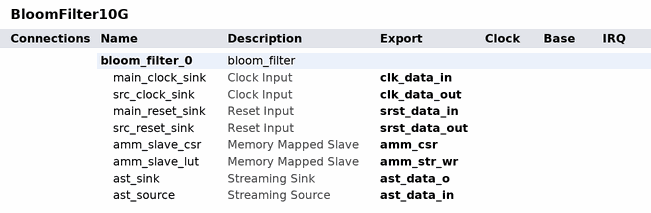
[diagram p0: system contents]
# Platform Designer (Qsys) system BloomFilter10G, Cyclone V 5CEBA2F17A7
# Parameters at their usual value, and those the tool derives, are not listed.
package require qsys
create_system BloomFilter10G
set_project_property DEVICE_FAMILY {Cyclone V}
set_project_property DEVICE 5CEBA2F17A7

add_instance bloom_filter_0 bloom_filter 1.0
set_instance_parameter_value bloom_filter_0 AMM_CSR_ADDR_W 4
set_instance_parameter_value bloom_filter_0 AMM_CSR_DATA_W 16
set_instance_parameter_value bloom_filter_0 AMM_LUT_ADDR_W 20
set_instance_parameter_value bloom_filter_0 AMM_LUT_DATA_W 8
set_instance_parameter_value bloom_filter_0 AST_SINK_ORDER true
set_instance_parameter_value bloom_filter_0 AST_SINK_SYMBOLS 8
set_instance_parameter_value bloom_filter_0 AST_SOURCE_ORDER true
set_instance_parameter_value bloom_filter_0 AST_SOURCE_SYMBOLS 1
set_instance_parameter_value bloom_filter_0 BYTE_W 8
set_instance_parameter_value bloom_filter_0 HASHES_CNT 4
set_instance_parameter_value bloom_filter_0 HASH_LUT_MODE 1
set_instance_parameter_value bloom_filter_0 HASH_W 13
set_instance_parameter_value bloom_filter_0 MAX_STR_SIZE 10
set_instance_parameter_value bloom_filter_0 MIN_STR_SIZE 4
set_instance_parameter_value bloom_filter_0 OUTPUT_FIFO_DEPTH 128

# exported interfaces
add_interface amm_csr avalon slave
set_interface_property amm_csr EXPORT_OF bloom_filter_0.amm_slave_csr
add_interface amm_str_wr avalon slave
set_interface_property amm_str_wr EXPORT_OF bloom_filter_0.amm_slave_lut
add_interface ast_data_in avalon_streaming source
set_interface_property ast_data_in EXPORT_OF bloom_filter_0.ast_source
add_interface ast_data_o avalon_streaming sink
set_interface_property ast_data_o EXPORT_OF bloom_filter_0.ast_sink
add_interface clk_data_in clock sink
set_interface_property clk_data_in EXPORT_OF bloom_filter_0.main_clock_sink
add_interface clk_data_out clock sink
set_interface_property clk_data_out EXPORT_OF bloom_filter_0.src_clock_sink
add_interface srst_data_in reset sink
set_interface_property srst_data_in EXPORT_OF bloom_filter_0.main_reset_sink
add_interface srst_data_out reset sink
set_interface_property srst_data_out EXPORT_OF bloom_filter_0.src_reset_sink

set_interconnect_requirement {$system} qsys_mm.clockCrossingAdapter HANDSHAKE
set_interconnect_requirement {$system} qsys_mm.enableEccProtection FALSE
set_interconnect_requirement {$system} qsys_mm.insertDefaultSlave FALSE
set_interconnect_requirement {$system} qsys_mm.maxAdditionalLatency 1

save_system BloomFilter10G.qsys
